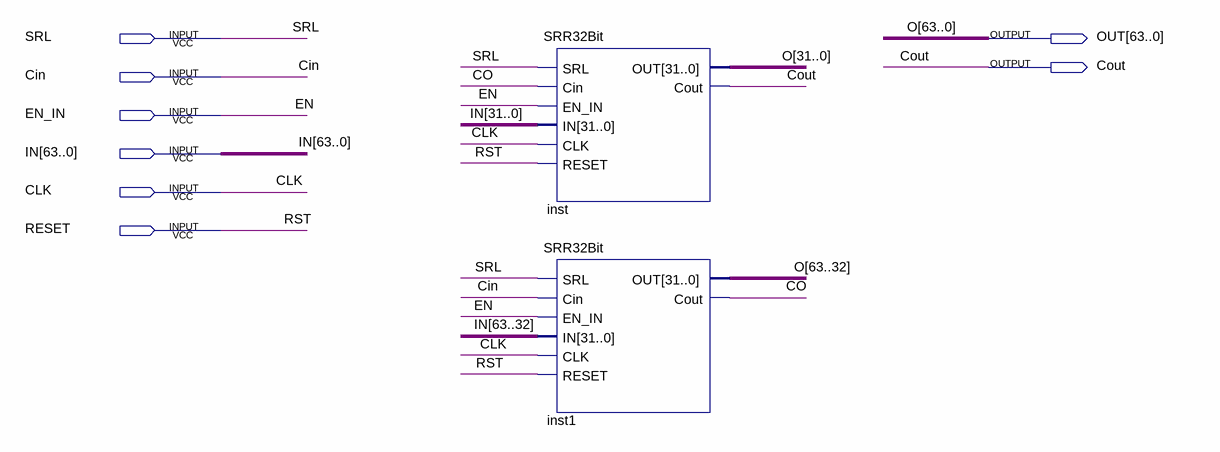
[diagram p0: schematic sheet]
// Quartus schematic SRR64Bit.bdf as structural Verilog: 2 symbols, 8 pins
module SRR64Bit (
  input  SRL,
  input  Cin,
  input  EN_IN,
  input  [63:0] IN,
  input  CLK,
  input  RESET,
  output [63:0] OUT,
  output Cout
);

  wire CO;

  SRR32Bit inst (
    .SRL(SRL), .Cin(CO), .EN_IN(EN_IN), .IN(IN[31:0]), .CLK(CLK), .RESET(RESET), .OUT(OUT[31:0]), .Cout(Cout));
  SRR32Bit inst1 (
    .SRL(SRL), .Cin(Cin), .EN_IN(EN_IN), .IN(IN[63:32]), .CLK(CLK), .RESET(RESET), .OUT(OUT[63:32]), .Cout(CO));

  // Other names for the same wires on the sheet: EN = EN_IN; O[63:0] = OUT; RST = RESET
endmodule
